# EAGLE design PCB-TCH-MENU2 (EAGLE 6.4)
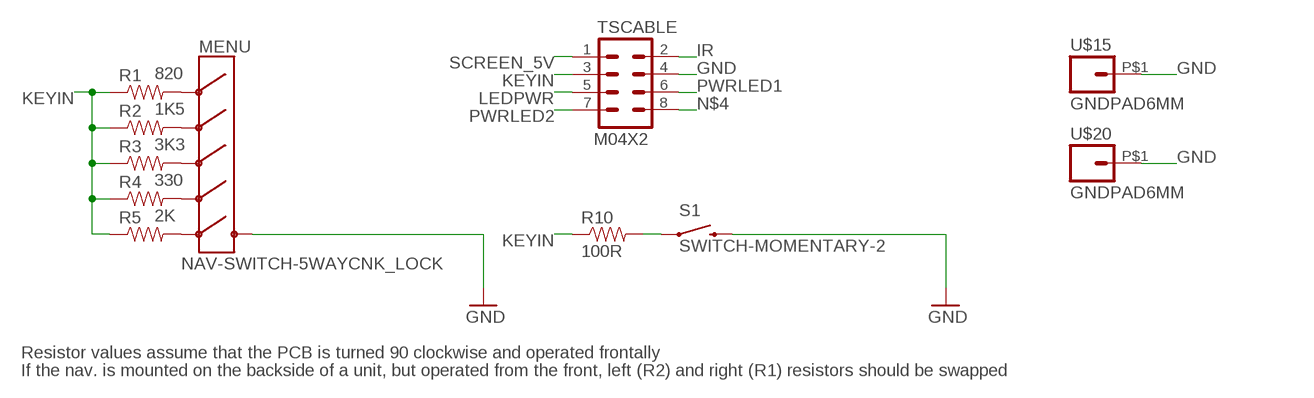
[diagram p0: schematic, sheet 1]

## Parts
MENU  NAV-SWITCH-5WAYCNK_LOCK  [NAV-SWITCH-5WAY]
R1  820  RESISTOR0603-RES  [0603-RES]
R2  1K5  RESISTOR0603-RES  [0603-RES]
R3  3K3  RESISTOR0603-RES  [0603-RES]
R4  330  RESISTOR0603-RES  [0603-RES]
R5  2K  RESISTOR0603-RES  [0603-RES]
R10  100R  RESISTOR0603-RES  [0603-RES]
S1  SWITCH-MOMENTARY-2  [TACTILE_SWITCH_TALL]
TSCABLE  M04X2  [2X4]
U$15  GNDPAD6MM  [3.2MMPAD6MM]
U$20  GNDPAD6MM  [3.2MMPAD6MM]

## Nets
GND [Power]: MENU.PIN4(COMMON) S1.B2 TSCABLE.4 U$15.P$1 U$20.P$1
IR: TSCABLE.2
KEYIN: R1.1 R2.1 R3.1 R4.1 R5.1 R10.1 TSCABLE.3
LEDPWR: TSCABLE.5
N$1: R10.2 S1.A2
N$2: MENU.PIN1(UP) R1.2
N$3: MENU.PIN3(DWN) R2.2
N$4: TSCABLE.8
N$5: MENU.PIN2(LEFT) R3.2
N$6: MENU.PIN5(RIGHT) R4.2
N$9: MENU.PIN6(PUSH) R5.2
PWRLED1: TSCABLE.6
PWRLED2: TSCABLE.7
SCREEN_5V [Power]: TSCABLE.1

## Notes on the sheet
- Resistor values assume that the PCB is turned 90 clockwise and operated frontally
- If the nav. is mounted on the backside of a unit, but operated from the front, left (R2) and right (R1) resistors should be swapped

## Library data of the parts
MENU = SKAARHOJ:NAV-SWITCH-5WAY: For use with a push-button switch made by CnK components. The Part # is
R1-R5 R10 = SparkFun:RESISTOR: Resistor Basic schematic elements and footprints for 0603, 1206, and PTH resistors.
S1 = SparkFun:SWITCH-MOMENTARY-2
TSCABLE = SparkFun:M04X2
U$15 U$20 = SKAARHOJ:GNDPAD

## Net classes
0 default: width 0.203 mm, drill 0.61 mm, clearance 0.203 mm
1 Power: width 0.406 mm, drill 0.61 mm, clearance 0.305 mm

## Board
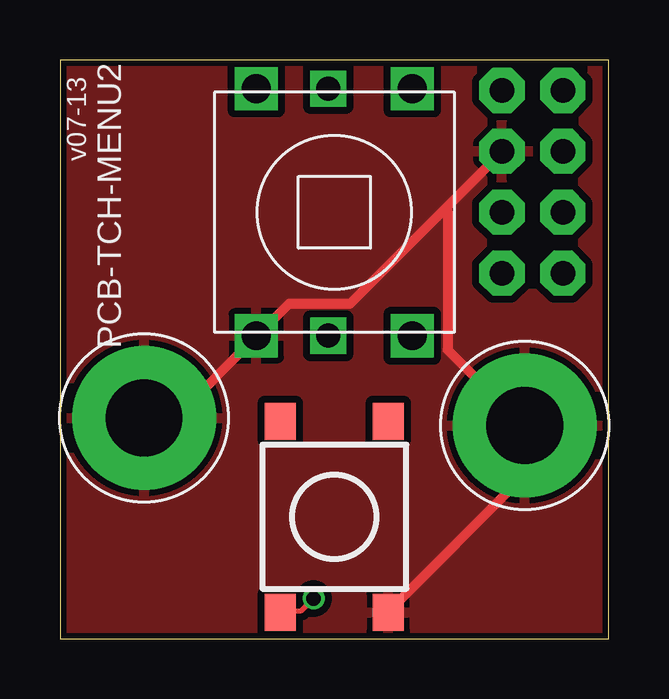
[diagram p1: board, top side]
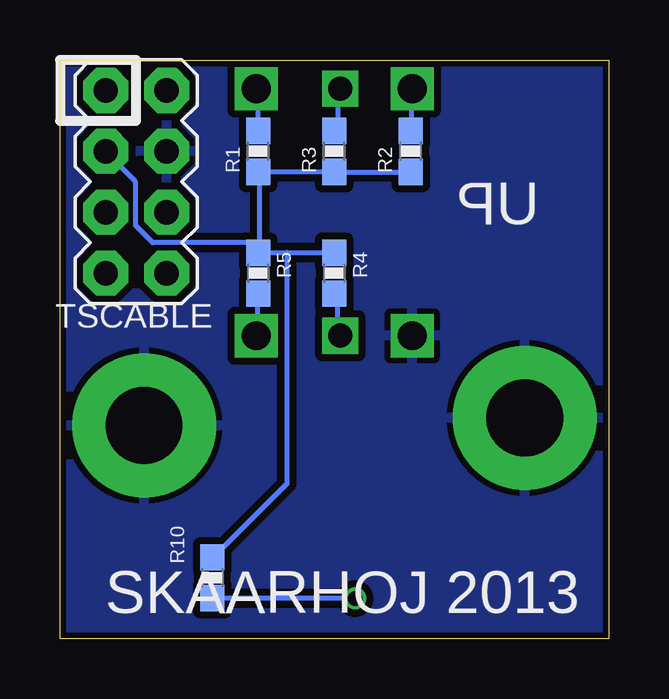
[diagram p2: board, bottom side, seen from below]

Size 22.86 x 24.13 mm. Coordinates in mm from the lower left corner, seen from the top.
Outline: 0,24.13 0,0 22.86,0 22.86,24.13 0,24.13
Copper layers (1*16): Top 0.035mm / dielectric 1.5mm / Bottom 0.035mm
Design rules "Fusion_eagle_rule_v1.1": minimum track width 6mil, minimum drill 12mil, track to track 6mil, track to pad 6mil, pad to pad 6mil, via to via 6mil, smd to smd 0mil, copper to edge 10mil, drill to drill 10mil, minimum pad ring 10mil, minimum via ring 6mil, stop-mask expansion 2mil, vias tented up to drill 100mil, thermal gap 10mil

### Footprints (pad centres in the part's own frame; a part is rotated, then mirrored left to right if it is on the bottom)
NAV-SWITCH-5WAY = drill 1.2 square: PIN1 -5.15,3.25; PIN3 -5.15,-3.25; PIN4 5.15,-3.25; PIN6 5.15,3.25 | drill 1 square: PIN2 -5.15,-0.25; PIN5 5.15,-0.25
0603-RES = smd 1.1 x 1: 1 -0.85,0; 2 0.85,0
TACTILE_SWITCH_TALL = smd 1.55 x 1.3: A1 -3.975,-2.25; A2 3.975,-2.25; B1 -3.975,2.25; B2 3.975,2.25
2X4 = drill 1.016 pad 1.88 octagon: 1 -3.81,-1.27; 2 -3.81,1.27; 3 -1.27,-1.27; 4 -1.27,1.27; 5 1.27,-1.27; 6 1.27,1.27; 7 3.81,-1.27; 8 3.81,1.27
3.2MMPAD6MM = drill 3.2 pad 6: P$1 0,0

### Placement (x,y rotation side)
MENU  11.43,17.78 270 top
R1  14.61,20.32 90 bottom
R2  8.26,20.32 90 bottom
R3  11.43,20.32 90 bottom
R4  11.43,15.24 270 bottom
R5  14.61,15.24 270 bottom
R10  16.51,2.54 270 bottom
S1  11.43,5.08 270 top
TSCABLE  19.68,19.05 270 bottom
U$15  3.5,9.2 270 top
U$20  19.36,8.89 270 top

### Tracks (layer width: path | path; a pad name or v marks a point on that pad's centre or on a via)
GND
  Top 0.406: S1.B2 13.72,1.17 19.3,6.76 19.3,8.89 U$20.P$1 19.2,8.99 16.15,12.04 16.15,17.83 16.05,17.93 | U$15.P$1 3.56,9.3 4.88,9.3 8.13,12.55 MENU.PIN4 8.33,12.75 9.55,13.97 12.09,13.97 16.05,17.93 | 16.05,17.93 18.39,20.27 TSCABLE.4
  pour Top: 0,0 22.86,0 22.86,24.13 0,24.13
  pour Bottom: 0,0 22.86,0 22.86,24.13 0,24.13
KEYIN
  Bottom 0.203: R2.1 8.33,19.46 11.38,19.46 R3.1 11.48,19.46 14.53,19.46 R1.1 14.53,19.36 14.53,16.51 | 13.41,16.1 14.53,16.1 R5.1 | 13.41,16.1 11.48,16.1 R4.1 | 13.41,16.1 13.41,6.45 16.46,3.4 R10.1 | 14.53,16.51 14.53,16.2 R5.1 | 14.53,16.51 19,16.51 19.71,17.22 19.71,19.05 20.93,20.27 TSCABLE.3 | 14.53,16.51 R5.1
N$1  (via drill 0.61)
  Top 0.203: v10.57,1.68 10.06,1.17 9.25,1.17 S1.A2
  Bottom 0.203: v10.57,1.68 16.46,1.68 R10.2
N$2
  Bottom 0.203: R1.2 14.63,21.18 14.63,22.91 MENU.PIN1
N$3
  Bottom 0.203: R2.2 8.23,21.18 8.23,22.91 MENU.PIN3
N$5
  Bottom 0.203: R3.2 11.38,21.18 11.28,21.29 11.28,22.91 MENU.PIN2
N$6
  Bottom 0.203: R4.2 11.38,14.38 11.28,14.28 11.28,12.65 MENU.PIN5
N$9
  Bottom 0.203: R5.2 14.63,14.38 14.63,12.65 MENU.PIN6

### Text on the board
Crop: Fusion: 61063
_tsilk: PCB-TCH-MENU2 | v07-13
_bsilk: UP | SKAARHOJ 2013